# EAGLE design openSX70-dongle_SEEED_v52 (EAGLE 9.2.0)
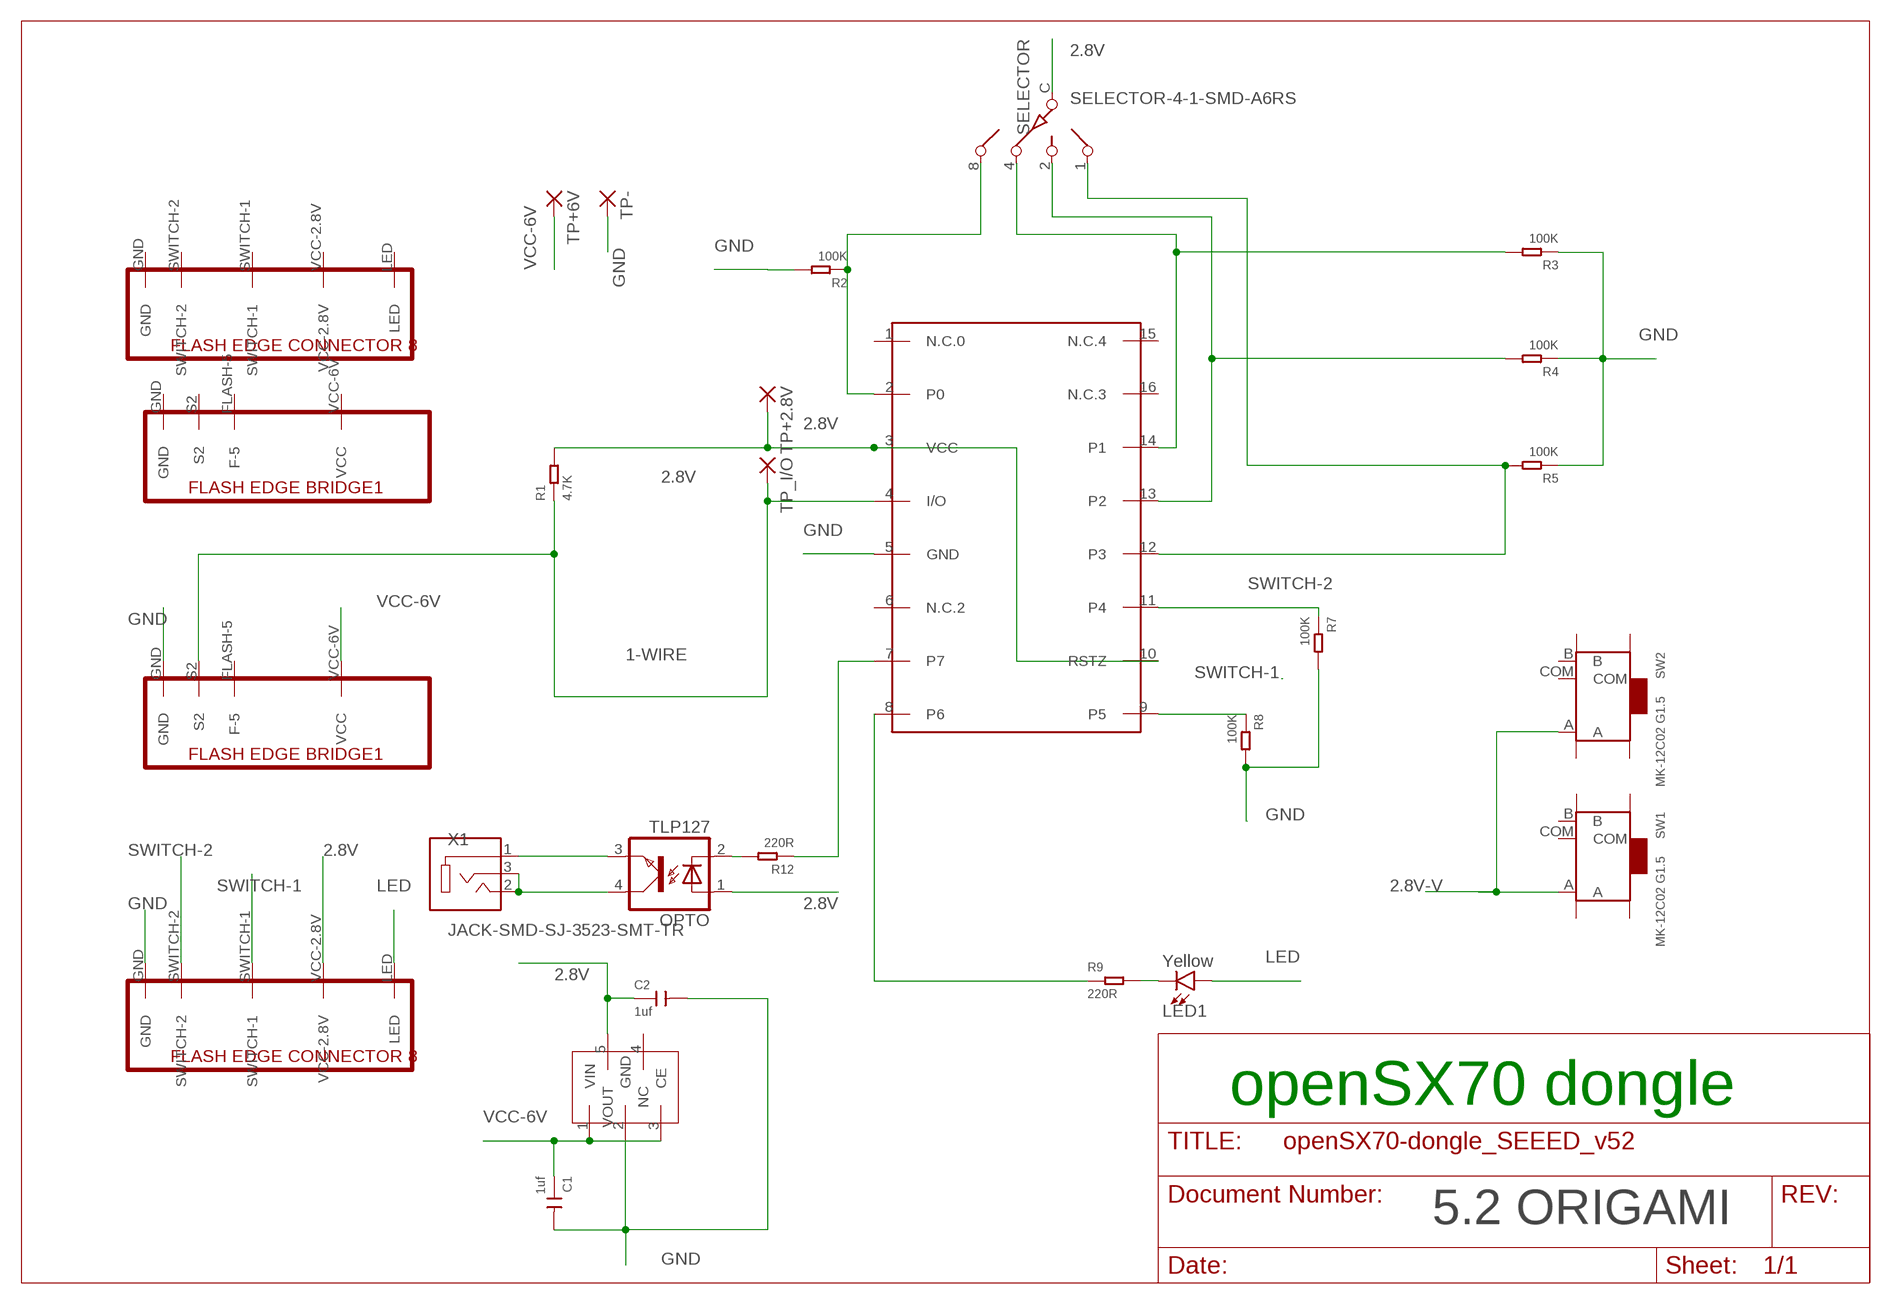
[diagram p0: schematic, sheet 1]

## Parts
C1  1uf  CERAMIC-1UF-25V-10%-X7R(0603)  [C0603]
C2  1uf  CERAMIC-1UF-25V-10%-X7R(0603)  [C0603]
DS2408  DS2408  [SO16]
LED1  Yellow  LED-YELLOWLILYPAD  [LED-1206]
OPTO  TLP127  [SO-4]
R1  4.7K  SMD-RES-4.7K-5%-1/10W(0603)  [R0603]
R2  100K  SMD-RES-100K-1%-1/10W(0603)  [R0603]
R3  100K  SMD-RES-100K-1%-1/10W(0603)  [R0603]
R4  100K  SMD-RES-100K-1%-1/10W(0603)  [R0603]
R5  100K  SMD-RES-100K-1%-1/10W(0603)  [R0603]
R7  100K  SMD-RES-100K-1%-1/10W(0603)  [R0603]
R8  100K  SMD-RES-100K-1%-1/10W(0603)  [R0603]
R9  220R  SMD-RES-220R-5%-1/10W(0603)  [R0603]
R12  220R  SMD-RES-220R-5%-1/10W(0603)  [R0603]
REG  NCP4688  [SOT-23-5]
SELECTOR  SELECTOR-4-1-SMD-A6RS  [A6RS-161RS]
SW1  MK-12C02 G1.5  SMD-TOGGLE-SWITCH-ON-ON(3+4P-6.7X2.7MM)  [SW7-SMD-L6.7X2.7X3.2MM]
SW2  MK-12C02 G1.5  SMD-TOGGLE-SWITCH-ON-ON(3+4P-6.7X2.7MM)  [SW7-SMD-L6.7X2.7X3.2MM]
TP+2.8V  SMD2  [SMD1,27-2,54]
TP+6V  SMD2  [SMD1,27-2,54]
TP-  SMD2  [SMD1,27-2,54]
TP_I/O  SMD2  [SMD1,27-2,54]
U$1  FLASH-BRIDGE-SW1-SW2-LED-SMALL  [FLASH-8-BRIDGE-SW1-SW2-LED-SMALL]
U$2  FLASH-BRIDGE1  [FLASH-8-BRIDGE1]
U$3  FLASH-BRIDGE-SW1-SW2-LED  [FLASH-8-BRIDGE-SW1-SW2-LED]
U$4  FLASH-BRIDGE-SMALL  [FLASH-8-BRIDGE1-SMALL]
X1  JACK-SMD-SJ-3523-SMT-TR  [CUI_SJ-3523-SMT-TR]

## Nets
1-WIRE: DS2408.4(I/O) R1.1 TP_I/O.1(P) U$2.S2
2.8V: C2.1 DS2408.3(VCC) DS2408.10(RSTZ) OPTO.1(A) R1.2 REG.5(VOUT) SELECTOR.C TP+2.8V.1(P) U$3.VCC-2.8V
2.8V-V: SW1.A SW2.A
GND: C1.2 C2.2 DS2408.5(GND) R2.2 R3.1 R4.1 R5.1 R7.2 R8.2 REG.2(GND) TP-.1(P) U$2.GND U$3.GND
LED: LED1.A U$3.LED
N$1: OPTO.3(EMIT) X1.1
N$2: LED1.C R9.2
N$3: DS2408.2(P0) R2.1 SELECTOR.8
N$4: DS2408.14(P1) R3.2 SELECTOR.4
N$5: DS2408.13(P2) R4.2 SELECTOR.2
N$7: DS2408.8(P6) R9.1
N$9: OPTO.4(COL) X1.2 X1.3
N$10: OPTO.2(C) R12.2
N$11: DS2408.7 R12.1
N$13: DS2408.12(P3) R5.2 SELECTOR.1
SWITCH-1: DS2408.9(P5) R8.1 U$3.SWITCH-1
SWITCH-2: DS2408.11(P4) R7.1 U$3.SWITCH-2
VCC-6V: C1.1 REG.1(VIN) REG.3(CE) TP+6V.1(P) U$2.VCC-6V(VCC)
Unconnected: DS2408.1(N.C.0) DS2408.6(N.C.2) DS2408.15(N.C.4) DS2408.16(N.C.3) REG.4(NC) SW1.B SW1.COM SW1.SS1 SW1.SS2 SW1.SS3 SW1.SS4 SW2.B SW2.COM SW2.SS1 SW2.SS2 SW2.SS3 SW2.SS4 U$1.GND U$1.LED U$1.SWITCH-1 U$1.SWITCH-2 U$1.VCC-2.8V U$2.FLASH-5(F-5) U$4.FLASH-5(F-5) U$4.GND U$4.S2 U$4.VCC-6V(VCC)

## Notes on the sheet
- openSX70 dongle
- 5.2 ORIGAMI

## Library data of the parts
C1 C2 = Seeed-Capacitor:CERAMIC-1UF-25V-10%-X7R(0603): 302010139; MPN: CC0603KRX7R8BB105
DS2408 = DS2408-joaco:DS2408
LED1 = SparkFun-LED:LED-YELLOW: Yellow SMD LED Used in manufacturing several products at SparkFun. Packages: 0603 - SMD 0603 package[Product Link] <http://www.kingbrightusa.com/product.asp?catalog_name=LED&product_id=APT1608SYCK> 0603 -SMART - SMART SMD 0603 package (more efficient/more expensive) [Product Link] <http://www.osram-os.com/osram_os/en/products/product-catalog/led-light-emitting-diodes/smartled-0603/ly-l29k/index.jsp> LilyPad - SMD1206 package[Product Datasheet] <https://www.sparkfun.com/datasheets/DevTools/LilyPad/Q150YUS4.pdf> SparkFun Products: Blynk Board <https://www.sparkfun.com/products/13794> IOIO-OTG <https://www.sparkfun.com/products/13613> XBee Explorer Serial <https://www.sparkfun.com/products/13225>; PROD_ID: DIO-09909
OPTO = openSX70:TLP127
R1 = Seeed-Resistor:SMD-RES-4.7K-5%-1/10W(0603): 301010290; MPN: RC0603JR-074K7L
R2-R5 R7 R8 = Seeed-Resistor:SMD-RES-100K-1%-1/10W(0603): 301010196; MPN: RC0603FR-07100KL
R9 R12 = Seeed-Resistor:SMD-RES-220R-5%-1/10W(0603): 301010163; MPN: RC0603JR-07220RL
REG = openSX70:NCP4688
SELECTOR = _openSX70:SELECTOR-4-1-SMD-A6RS
SW1 SW2 = Seeed-Switch:SMD-TOGGLE-SWITCH-ON-ON(3+4P-6.7X2.7MM): 311030001; MPN: MK-12C02 G1.5
TP+2.8V TP+6V TP- TP_I/O = wirepad:SMD2: SMD PAD
U$1 = _openSX70:FLASH-BRIDGE-SW1-SW2-LED-SMALL
U$2 = _openSX70:FLASH-BRIDGE1
U$3 = _openSX70:FLASH-BRIDGE-SW1-SW2-LED
U$4 = _openSX70:FLASH-BRIDGE-SMALL
X1 = _openSX70:JACK-SMD-SJ-3523-SMT-TR: Audio Jack Connector 3.5 mm Low Profile Surface Mount Stereo Jack, 3 Pin Right-Angle; AVAILABILITY: Unavailable; CUI_PURCHASE_URL: https://www.cui.com/product/interconnect/audio-connectors/3.5-mm-jacks/sj-352x-smt-series?utm_source=snapeda.com&utm_medium=referral&utm_campaign=snapedaBOM; DESCRIPTION: SJ Series 3.5 mm 12 V SMT Right Angle Stereo Audio Jack; MF: CUI Inc.; MP: SJ-3523-SMT-TR; PACKAGE: LGA-10 STMicroelectronics; PRICE: None

## Net classes
0 GND: width 0.305 mm
1 VCC: width 0.254 mm
2 2.8V: width 0.254 mm

## Board
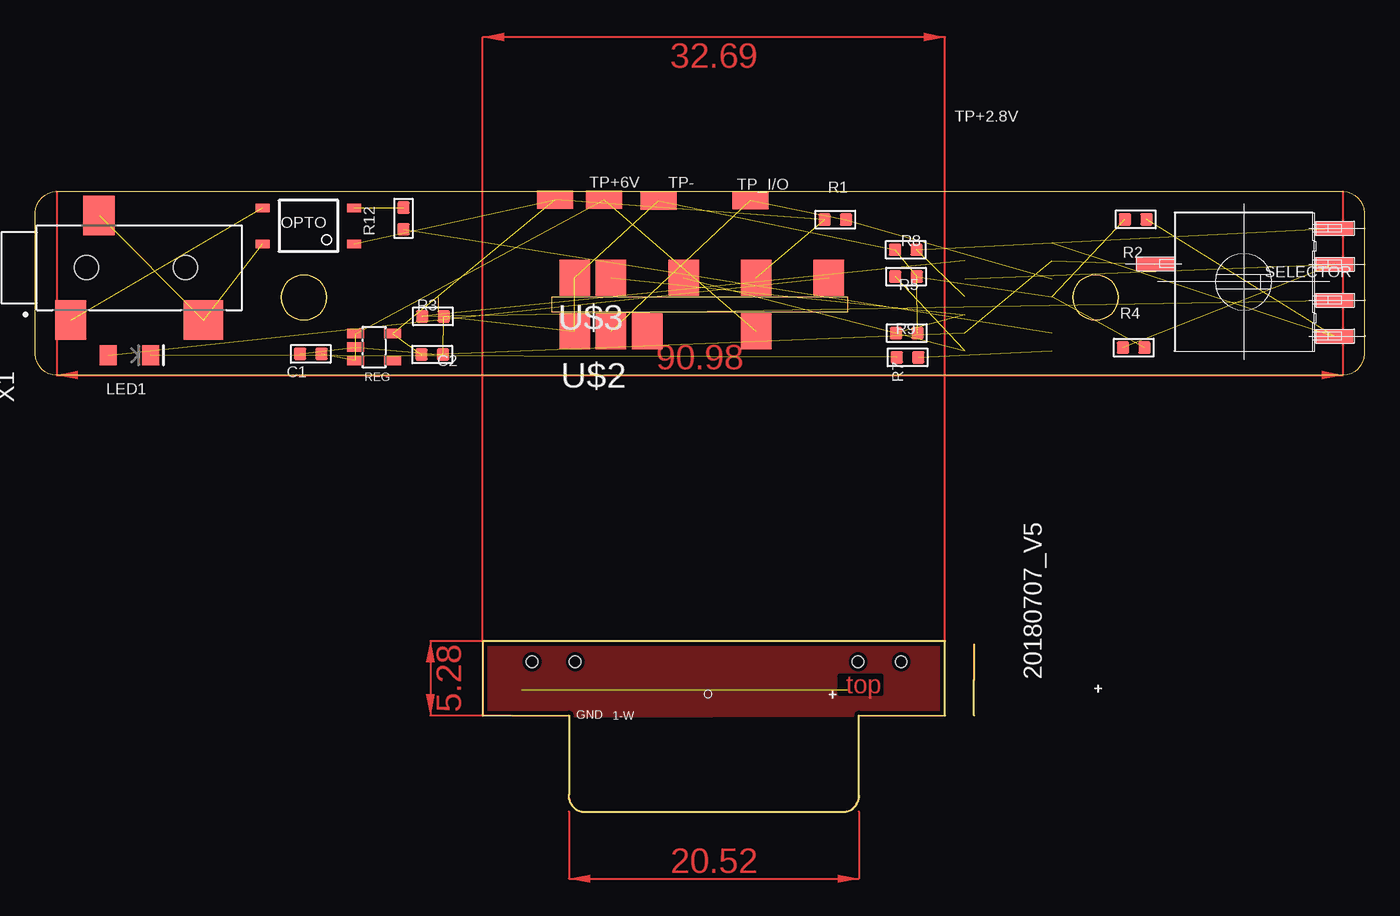
[diagram p1: board, top side]
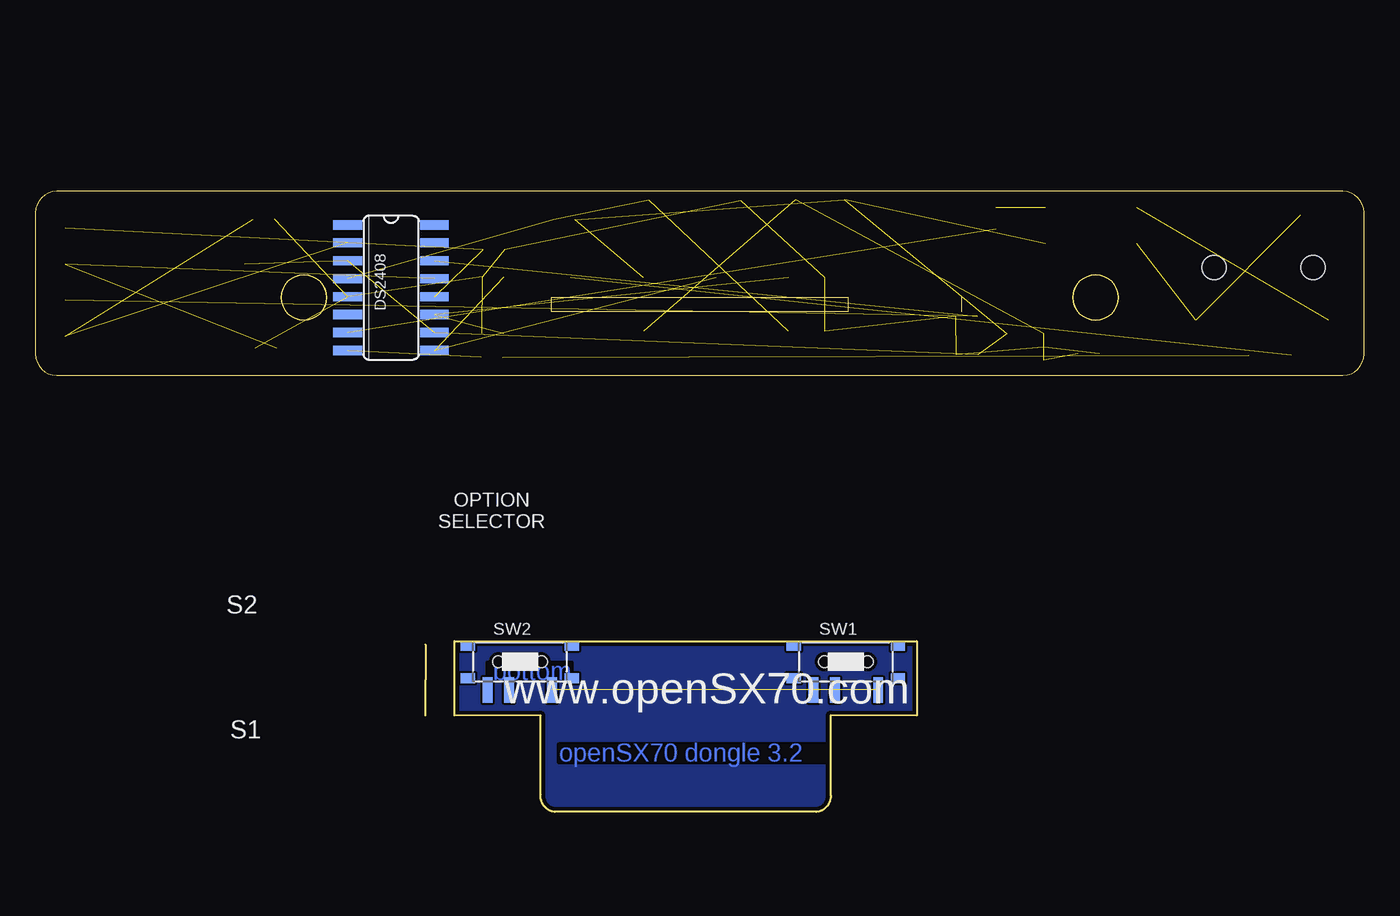
[diagram p2: board, bottom side, seen from below]

Size 94 x 43.88 mm. Coordinates in mm from the lower left corner, seen from the top.
Outline: 58.28,6.71 58.26,6.83
Outline: 58.26,6.83 58.26,1.24 arc-90 57.24,0 38.75,0 arc-90 37.74,1.24 37.74,6.83 31.65,6.8 31.65,12.09 64.34,12.09 64.34,6.8 58.26,6.83
Outline: 75,37.98 75.32,37.95 75.62,37.86 75.9,37.71 76.14,37.51
Outline: 76.14,37.51 76.33,37.28 76.48,37 76.57,36.7 76.61,36.38
Outline: 76.61,36.38 76.57,36.05 76.48,35.75 76.33,35.48 76.14,35.24
Outline: 76.14,35.24 75.9,35.05 75.62,34.9 75.32,34.81 75,34.77
Outline: 75,34.77 74.68,34.81 74.38,34.9 74.1,35.05 73.87,35.24
Outline: 73.87,35.24 73.67,35.48 73.52,35.75 73.43,36.05 73.4,36.38
Outline: 73.4,36.38 73.43,36.7 73.52,37 73.67,37.28 73.87,37.51
Outline: 73.87,37.51 74.1,37.71 74.38,37.86 74.68,37.95 75,37.98
Outline: 19,37.98 19.32,37.95 19.62,37.86 19.9,37.71 20.14,37.51
Outline: 20.14,37.51 20.33,37.28 20.48,37 20.57,36.7 20.61,36.38
Outline: 20.61,36.38 20.57,36.05 20.48,35.75 20.33,35.48 20.14,35.24
Outline: 20.14,35.24 19.9,35.05 19.62,34.9 19.32,34.81 19,34.77
Outline: 19,34.77 18.68,34.81 18.38,34.9 18.1,35.05 17.87,35.24
Outline: 17.87,35.24 17.67,35.48 17.52,35.75 17.43,36.05 17.4,36.38
Outline: 17.4,36.38 17.43,36.7 17.52,37 17.67,37.28 17.87,37.51
Outline: 17.87,37.51 18.1,37.71 18.38,37.86 18.68,37.95 19,37.98
Outline: 75,37.98 74.69,37.95 74.39,37.86 74.11,37.71 73.87,37.51
Outline: 73.87,37.51 73.67,37.27 73.52,36.99 73.43,36.69 73.4,36.38
Outline: 73.4,36.38 73.43,36.07 73.52,35.76 73.67,35.49 73.87,35.24
Outline: 73.87,35.24 74.11,35.04 74.39,34.9 74.69,34.8 75,34.77
Outline: 75,34.77 75.31,34.8 75.61,34.9 75.89,35.04 76.14,35.24
Outline: 76.14,35.24 76.33,35.49 76.48,35.76 76.57,36.07 76.61,36.38
Outline: 76.61,36.38 76.57,36.69 76.48,36.99 76.33,37.27 76.14,37.51
Outline: 76.14,37.51 75.89,37.71 75.61,37.86 75.31,37.95 75,37.98
Outline: 19,37.98 18.69,37.95 18.39,37.86 18.11,37.71 17.87,37.51
Outline: 17.87,37.51 17.67,37.27 17.52,36.99 17.43,36.69 17.4,36.38
Outline: 17.4,36.38 17.43,36.07 17.52,35.76 17.67,35.49 17.87,35.24
Outline: 17.87,35.24 18.11,35.04 18.39,34.9 18.69,34.8 19,34.77
Outline: 19,34.77 19.31,34.8 19.61,34.9 19.89,35.04 20.14,35.24
Outline: 20.14,35.24 20.33,35.49 20.48,35.76 20.57,36.07 20.61,36.38
Outline: 20.61,36.38 20.57,36.69 20.48,36.99 20.33,37.27 20.14,37.51
Outline: 20.14,37.51 19.89,37.71 19.61,37.86 19.31,37.95 19,37.98
Outline: 28.5,36.38 28.5,35.38
Outline: 1.51,43.88 92.49,43.88 92.8,43.85 93.08,43.76 93.33,43.62 93.56,43.44 93.74,43.21 93.88,42.96 93.97,42.67 94,42.37 94,32.39 93.97,32.08 93.88,31.8 93.74,31.54 93.56,31.32 93.33,31.14 93.08,31 92.8,30.91 92.49,30.88 1.51,30.88 1.2,30.91 0.92,31 0.67,31.14 0.44,31.32 0.26,31.54 0.12,31.8 0.03,32.08 0,32.39 0,42.37 0.03,42.67 0.12,42.96 0.26,43.21 0.44,43.44 0.67,43.62 0.92,43.76 1.2,43.85 1.51,43.88
Outline: 36.5,35.38 57.5,35.38 57.5,36.38 36.5,36.38 36.5,35.38
Copper layers (1*16): Top 0.035mm / dielectric 1.5mm / Bottom 0.035mm
Design rules "SeeedStudio_2layer_DRU_no_angle_20140221": minimum track width 6mil, minimum drill 12mil, track to track 6mil, track to pad 6mil, pad to pad 6mil, via to via 6mil, smd to smd 0mil, copper to edge 10mil, drill to drill 10mil, minimum pad ring 10mil, minimum via ring 6mil, stop-mask expansion 2mil, vias tented up to drill 100mil, thermal gap 10mil

### Footprints (pad centres in the part's own frame; a part is rotated, then mirrored left to right if it is on the bottom)
C0603 = smd 0.889 x 0.889: 1 0,0.762; 2 0,-0.762
SO16 = smd 0.66 x 2.032: 1 -4.445,-3.073; 2 -3.175,-3.073; 3 -1.905,-3.073; 4 -0.635,-3.073; 5 0.635,-3.073; 6 1.905,-3.073; 7 3.175,-3.073; 8 4.445,-3.073; 9 4.445,3.073; 10 3.175,3.073; 11 1.905,3.073; 12 0.635,3.073; 13 -0.635,3.073; 14 -1.905,3.073; 15 -3.175,3.073; 16 -4.445,3.073
LED-1206 = smd 1.2 x 1.4: A -1.5,0; C 1.5,0
SO-4 = smd 1 x 0.6: 1 -3.24,0.635; 2 -3.24,-1.905; 3 3.24,-1.905; 4 3.24,0.635
R0603 = smd 0.889 x 0.889: 1 0,0.762; 2 0,-0.762
SOT-23-5 = smd 0.69 x 1.2: 1 -0.95,-1.3; 2 0,-1.3; 3 0.95,-1.3; 4 0.95,1.3; 5 -0.95,1.3
A6RS-161RS = smd 1 x 2.7: 1 8.89,-1.397; 2 6.35,-1.397; 4 3.81,-1.397; 8 1.27,-1.397; C 6.35,11.303
SW7-SMD-L6.7X2.7X3.2MM = smd 1.8 x 0.7: A 1.978,2.286; B 1.978,-2.286; COM 1.978,-0.762 | smd 0.7 x 1.016: SS1 -1.15,-3.683; SS2 1.15,-3.683; SS3 1.15,3.683; SS4 -1.15,3.683 | hole 0.813: 0,-1.524; 0,1.524
SMD1,27-2,54 = smd 1.27 x 2.54: 1 0,0
FLASH-8-BRIDGE1 = smd 2.159 x 2.54: FLASH-5 -3.86,7.5; GND -9,7.5; S2 -6.43,7.5; VCC-6V 3.85,7.5
FLASH-8-BRIDGE-SW1-SW2-LED = smd 2.159 x 2.54: GND -9,7.5; LED 8.99,7.5; SWITCH-1 -1.29,7.5; SWITCH-2 -6.43,7.5; VCC-2.8V 3.85,7.5
CUI_SJ-3523-SMT-TR = smd 2.2 x 2.8: 1 -1.1,-3.7; 3 0.9,3.7 | smd 2.8 x 2.8: 2 8.3,-3.7 | hole 1.7: 0,0; 7,0

### Placement (x,y rotation side)
C1  19.48,32.39 270 top
C2  28.08,32.35 90 top
DS2408  68.84,37.07 270 bottom
LED1  6.65,32.29 0 top
OPTO  19.32,40.81 180 top
R1  56.59,41.88 270 top
R2  77.84,41.9 270 top
R3  28.13,35.04 270 top
R4  77.7,32.83 270 top
R5  61.58,39.75 90 top
R7  61.65,33.86 90 top
R8  61.59,37.86 90 top
R9  61.7,32.15 270 top
R12  26.04,41.97 180 top
REG  23.97,32.87 270 top
SELECTOR  90.49,32.37 90 top
SW1  36.66,10.62 270 bottom
SW2  59.72,10.62 270 bottom
TP+2.8V  36.76,43.29 90 top
TP+6V  40.23,43.28 90 top
TP-  44.07,43.21 90 top
TP_I/O  50.6,43.24 90 top
U$2  47.14,26.49 0 top
U$3  47.14,30.29 0 top
X1  3.6,38.49 0 top

### Tracks (layer width: path | path; a pad name or v marks a point on that pad's centre or on a via)
1-WIRE  (3 unrouted)
2.8V  (8 unrouted)
2.8V-V  (1 unrouted)
GND  (12 unrouted)
  pour Top: 31.54,11.78 64.31,11.84 64.31,6.76 31.54,6.7
  pour Bottom: 31.64,11.89 31.64,6.71 37.58,6.71 37.58,0.36 57.9,0.36 57.9,6.71 64.38,6.61 64.38,11.83
LED  (1 unrouted)
N$1  (1 unrouted)
N$2  (1 unrouted)
N$3  (2 unrouted)
N$4  (2 unrouted)
N$5  (2 unrouted)
N$7  (1 unrouted)
N$9  (2 unrouted)
N$10  (1 unrouted)
N$11  (1 unrouted)
N$13  (2 unrouted)
SWITCH-1  (2 unrouted)
SWITCH-2  (2 unrouted)
VCC-6V  (4 unrouted)
(copper drawn outside any net)
  shapes: Top area x4

### Text on the board
Top: top
Bottom: bottom | openSX70 dongle 3.2
tPlace: 20180707_V5 | + | +
bPlace: www.openSX70.com
tNames: GND | 1-W
bNames: OPTION / SELECTOR | S2 | S1